# EAGLE schematic openDebugger (EAGLE 6.6.0)
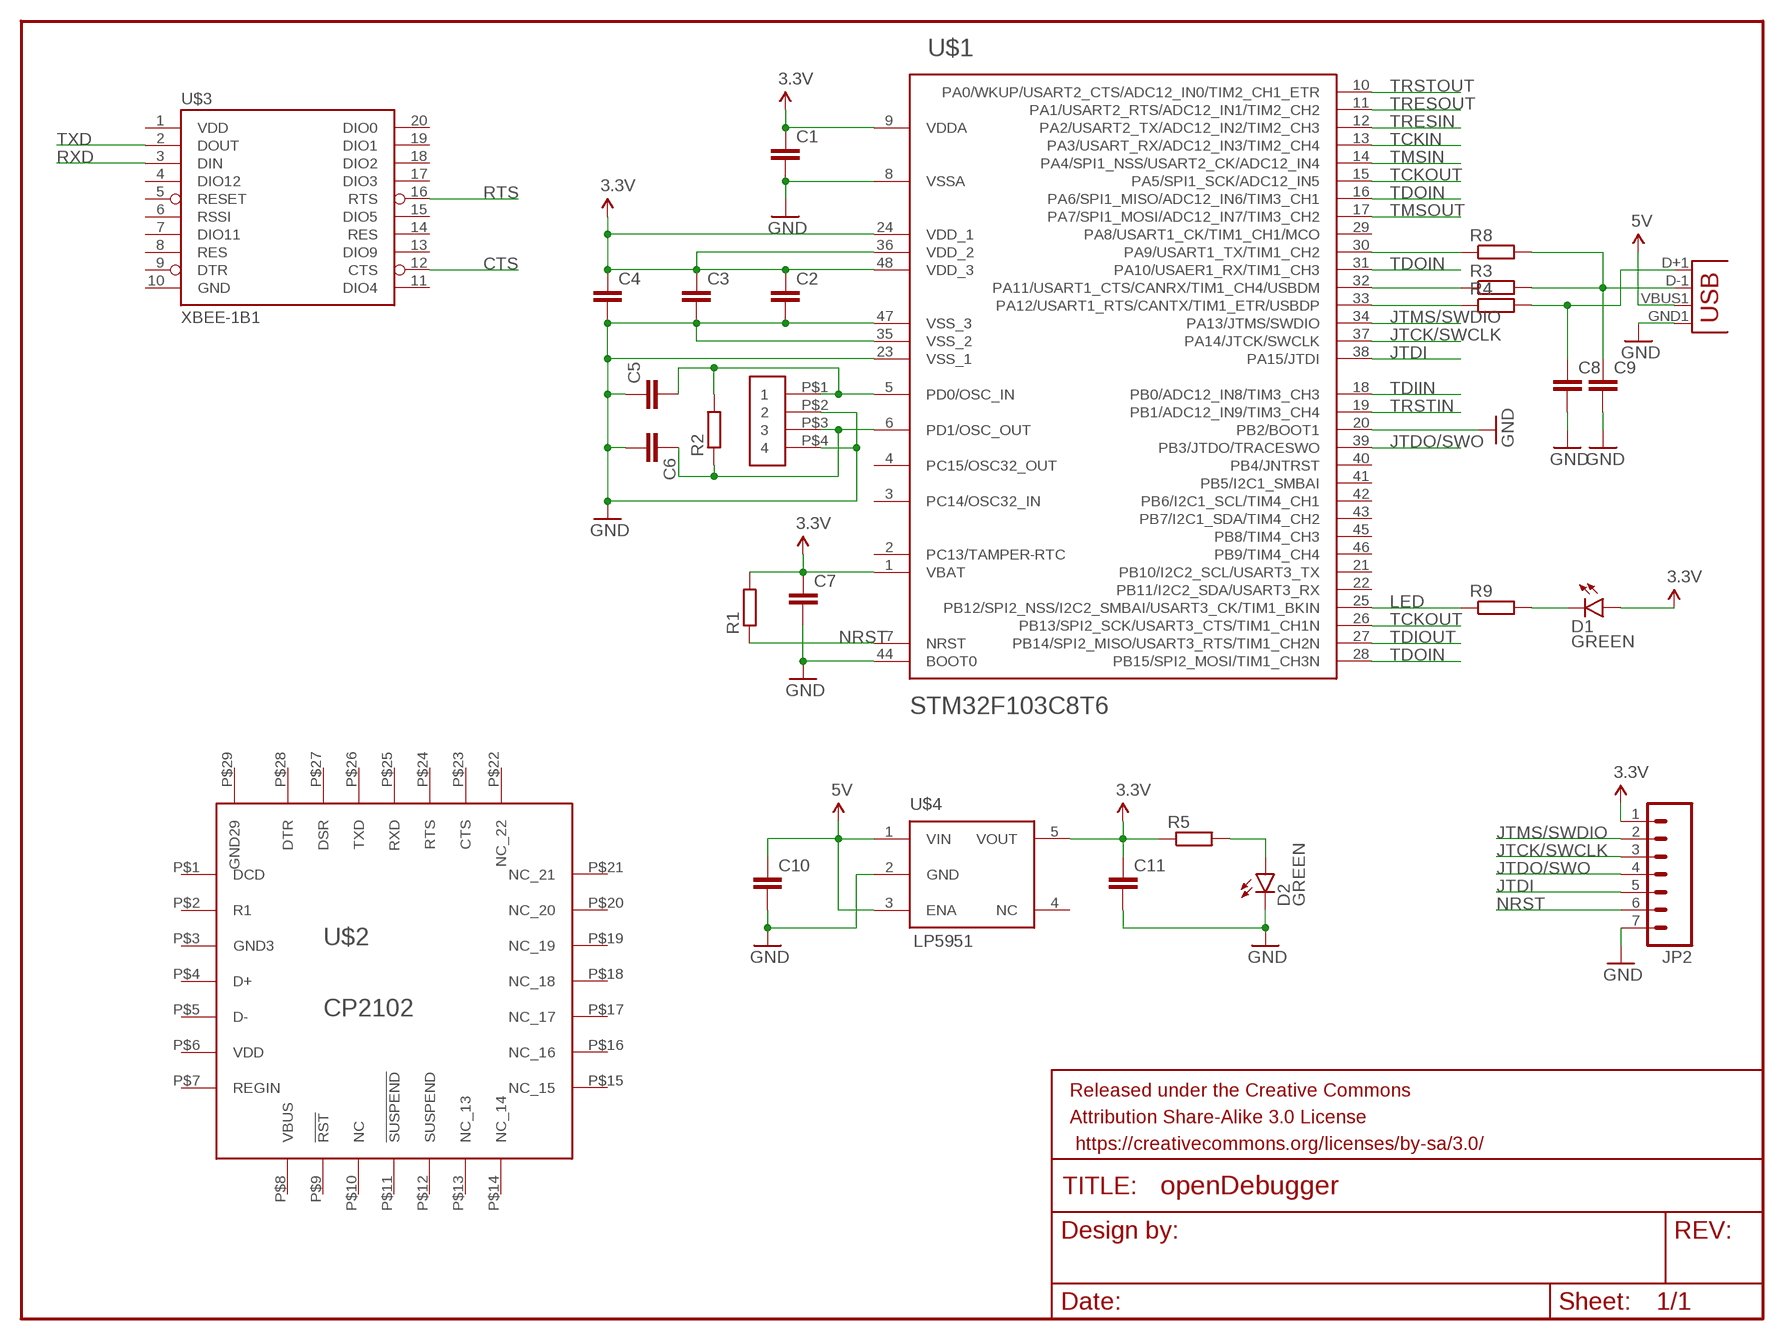
[diagram p0: schematic, sheet 1]

## Parts
C1  C-EUC0402  [C0402]
C2  C-EUC0402  [C0402]
C3  C-EUC0402  [C0402]
C4  C-EUC0402  [C0402]
C5  C-EUC0402  [C0402]
C6  C-EUC0402  [C0402]
C7  C-EUC0402  [C0402]
C8  C-EUC0402K  [C0402K]
C9  C-EUC0402K  [C0402K]
C10  C-EUC0402  [C0402]
C11  C-EUC0402  [C0402]
D1  GREEN  LED-GREEN0603  [LED-0603]
D2  GREEN  LED-GREEN0603  [LED-0603]
FRAME1  FRAME-LETTER  [CREATIVE_COMMONS]
JP1  USBA-SMD-MALE  [USB-A-SMT-MALE]
JP2  M07  [1X07]
R1  R-EU_R0402  [R0402]
R2  R-EU_R0402  [R0402]
R3  R-EU_R0402  [R0402]
R4  R-EU_R0402  [R0402]
R5  R-EU_R0402  [R0402]
R8  R-EU_R0402  [R0402]
R9  R-EU_R0402  [R0402]
U$1  STM32F103C8T6  [LQFP48-7X7]
U$2  CP2102  [QFN28-5X5]
U$3  XBEE-1B1  [XBEE-1]
U$4  LP5951  [SC70]
U$5  ABM3B  [ABM3B_5.0X3.2]

## Nets
3.3V: C1.1 C2.1 C3.1 C4.1 C7.1 C11.1 D1.A JP2.1 R1.2 R5.1 U$1.1(VBAT) U$1.9(VDDA) U$1.24(VDD_1) U$1.36(VDD_2) U$1.48(VDD_3) U$4.5(VOUT)
5V: C10.1 JP1.VBUS1(VBUS) U$4.1(VIN) U$4.3(ENA)
CTS: U$3.12(CTS)
GND: C1.2 C2.2 C3.2 C4.2 C5.1 C6.2 C7.2 C8.2 C9.2 C10.2 C11.2 D2.C JP1.GND1(GND) JP2.7 U$1.8(VSSA) U$1.20(PB2/BOOT1) U$1.23(VSS_1) U$1.35(VSS_2) U$1.44(BOOT0) U$1.47(VSS_3) U$4.2(GND) U$5.P$2 U$5.P$4
JTCK/SWCLK: JP2.3 U$1.37(PA14/JTCK/SWCLK)
JTDI: JP2.5 U$1.38(PA15/JTDI)
JTDO/SWO: JP2.4 U$1.39(PB3/JTDO/TRACESWO)
JTMS/SWDIO: JP2.2 U$1.34(PA13/JTMS/SWDIO)
LED: R9.1 U$1.25(PB12/SPI2_NSS/I2C2_SMBAI/USART3_CK/TIM1_BKIN)
N$1: C5.2 R2.2 U$1.5(PD0/OSC_IN) U$5.P$1
N$2: R8.1 U$1.30(PA9/USART1_TX/TIM1_CH2)
N$3: C6.1 R2.1 U$1.6(PD1/OSC_OUT) U$5.P$3
N$4: R3.1 U$1.32(PA11/USART1_CTS/CANRX/TIM1_CH4/USBDM)
N$5: R4.1 U$1.33(PA12/USART1_RTS/CANTX/TIM1_ETR/USBDP)
N$6: C9.1 JP1.D-1(D-) R3.2 R8.2
N$8: C8.1 JP1.D+1(D+) R4.2
N$9: D2.A R5.2
N$10: D1.C R9.2
NRST: JP2.6 R1.1 U$1.7(NRST)
RTS: U$3.16(RTS)
RXD: U$3.3(DIN)
TCKIN: U$1.13(PA3/USART_RX/ADC12_IN3/TIM2_CH4)
TCKOUT: U$1.15(PA5/SPI1_SCK/ADC12_IN5) U$1.26(PB13/SPI2_SCK/USART3_CTS/TIM1_CH1N)
TDIIN: U$1.18(PB0/ADC12_IN8/TIM3_CH3)
TDIOUT: U$1.27(PB14/SPI2_MISO/USART3_RTS/TIM1_CH2N)
TDOIN: U$1.16(PA6/SPI1_MISO/ADC12_IN6/TIM3_CH1) U$1.28(PB15/SPI2_MOSI/TIM1_CH3N) U$1.31(PA10/USAER1_RX/TIM1_CH3)
TMSIN: U$1.14(PA4/SPI1_NSS/USART2_CK/ADC12_IN4)
TMSOUT: U$1.17(PA7/SPI1_MOSI/ADC12_IN7/TIM3_CH2)
TRESIN: U$1.12(PA2/USART2_TX/ADC12_IN2/TIM2_CH3)
TRESOUT: U$1.11(PA1/USART2_RTS/ADC12_IN1/TIM2_CH2)
TRSTIN: U$1.19(PB1/ADC12_IN9/TIM3_CH4)
TRSTOUT: U$1.10(PA0/WKUP/USART2_CTS/ADC12_IN0/TIM2_CH1_ETR)
TXD: U$3.2(DOUT)
Unconnected: U$1.2(PC13/TAMPER-RTC) U$1.3(PC14/OSC32_IN) U$1.4(PC15/OSC32_OUT) U$1.21(PB10/I2C2_SCL/USART3_TX) U$1.22(PB11/I2C2_SDA/USART3_RX) U$1.29(PA8/USART1_CK/TIM1_CH1/MCO) U$1.40(PB4/JNTRST) U$1.41(PB5/I2C1_SMBAI) U$1.42(PB6/I2C1_SCL/TIM4_CH1) U$1.43(PB7/I2C1_SDA/TIM4_CH2) U$1.45(PB8/TIM4_CH3) U$1.46(PB9/TIM4_CH4) U$2.P$1(DCD) U$2.P$2(R1) U$2.P$3(GND3) U$2.P$4(D+) U$2.P$5(D-) U$2.P$6(VDD) U$2.P$7(REGIN) U$2.P$8(VBUS) U$2.P$9(!RST) U$2.P$10(NC) U$2.P$11(!SUSPEND) U$2.P$12(SUSPEND) U$2.P$13(NC_13) U$2.P$14(NC_14) U$2.P$15(NC_15) U$2.P$16(NC_16) U$2.P$17(NC_17) U$2.P$18(NC_18) U$2.P$19(NC_19) U$2.P$20(NC_20) U$2.P$21(NC_21) U$2.P$22(NC_22) U$2.P$23(CTS) U$2.P$24(RTS) U$2.P$25(RXD) U$2.P$26(TXD) U$2.P$27(DSR) U$2.P$28(DTR) U$2.P$29(GND29) U$3.4(DIO12) U$3.5(RESET) U$3.6(RSSI) U$3.7(DIO11) U$3.8(RES) U$3.9(DTR) U$3.11(DIO4) U$3.13(DIO9) U$3.14(RES) U$3.15(DIO5) U$3.17(DIO3) U$3.18(DIO2) U$3.19(DIO1) U$3.20(DIO0) U$4.4(NC)

## Power pins joined to a net without a drawn wire
GND: U$3.10(GND)
VDD: U$3.1(VDD)

## Library data of the parts
C1-C11 = openmotestm:C-EU: CAPACITOR, European symbol
D1 D2 = openmotestm:LED-GREEN: Various green LEDs Green LEDs used in SFE Production 0603- DIO-00821 LARGE- DIO-00862 LILYPAD- DIO-09910; PROD_ID: DIO-00821
FRAME1 = openmotestm:FRAME-LETTER: Schematic Frame Standard 8.5x11 US Letter frame
JP1 = openmotestm:USB: USB Connectors USB-B-PTH is fully proven SKU : PRT-00139/CONN-08278 USB-miniB is fully proven SKU : PRT-00587 USB-A-PCB is untested. USB-A-H is throughly reviewed, but untested. Spark Fun Electronics SKU : PRT-00437 USB-B-SMT is throughly reviewed, but untested. Needs silkscreen touching up. USB-A-S has not been used/tested USB-MB-H has not been used/tested USB-MICROB has been used. CONN-09505
JP2 = openmotestm:M07: Header 7 Standard 7-pin 0.1" header. Use with straight break away headers (SKU : PRT-00116), right angle break away headers (PRT-00553), swiss pins (PRT-00743), machine pins (PRT-00117), and female headers (PRT-00115). NOTES ON THE VARIANTS LOCK and LOCK_LONGPADS... This footprint was designed to help hold the alignment of a through-hole component (i.e. 7-pin header) while soldering it into place. You may notice that each hole has been shifted either up or down by 0.005 of an inch from it's more standard position (which is usually a perfectly straight line). This slight alteration caused the pins (the squares in the middle) to touch the edges of the holes. Because they are alternating, it causes a "brace" to hold the header in place. 0.005 has proven to be the perfect amount of "off-center" position when using our standard breakaway headers. Although looks a little odd when you look at the bare footprint, once you have a header in there, the alteration is very hard to notice. Also, if you push a header all the way into place, it is covered up entirely on the bottom side. This idea of altering the position of holes to aid alignment will be further integrated into the Sparkfun Library for other footprints. It can help hold any component with 3 or more connection pins.
R1-R5 R8 R9 = openmotestm:R-EU_: RESISTOR, European symbol
U$1 = openmotestm:STM32F103C8T6: STM32F103xx performance line LQFP48 pinout
U$2 = openmotestm:CP2102: silicon lab cp2102 signal chip usb to uart bridge
U$3 = openmotestm:XBEE-1: Xbee module footprints SMT header is CONN-09042.
U$4 = openmotestm:LP5951: LP5951MG-3.3V
U$5 = openmotestm:ABM3B